# EAGLE schematic OwlPedal (EAGLE 9.6.1)
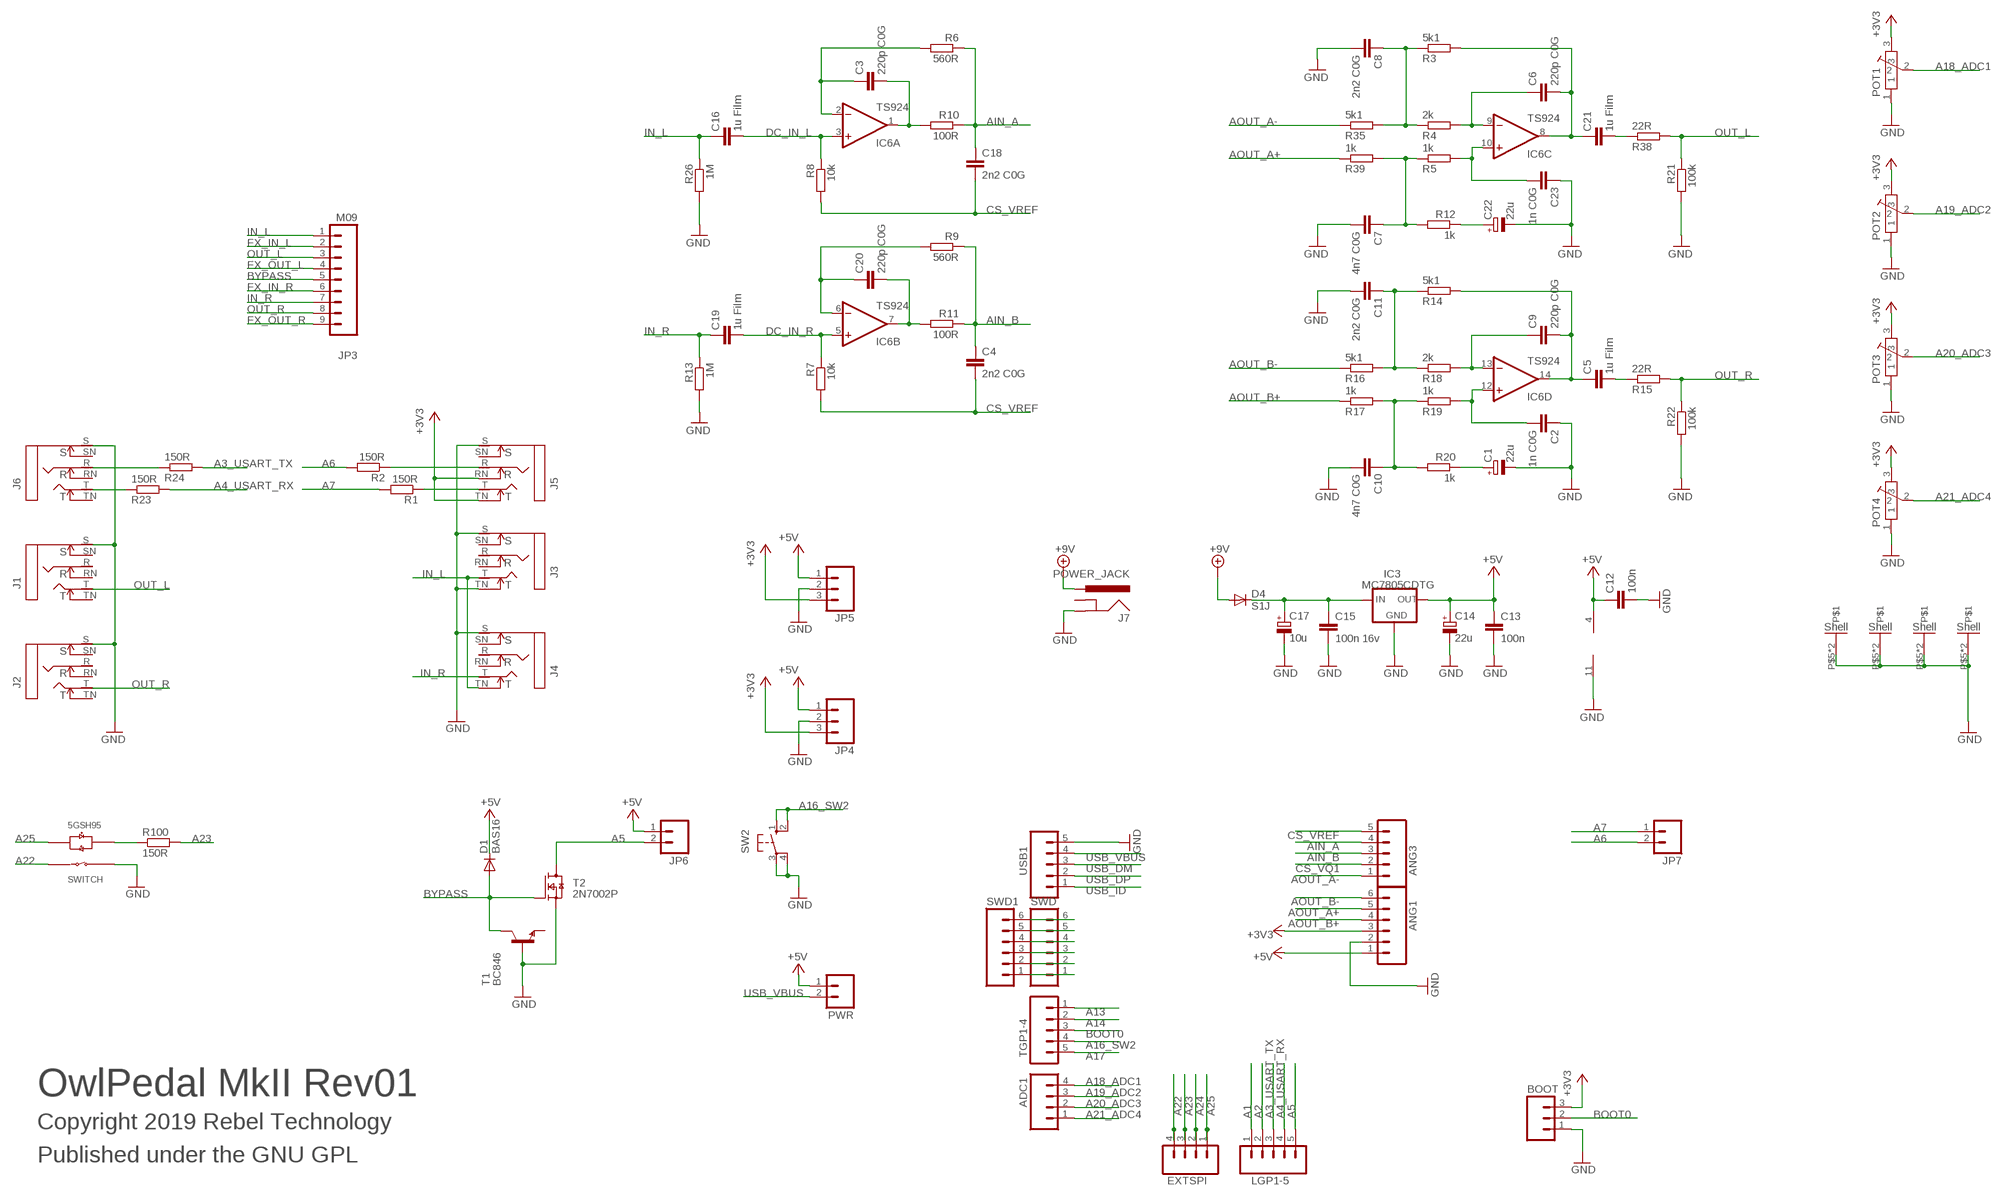
[diagram p0: schematic, sheet 1]

## Parts
ADC1  M04PTH  [1X04]
ANG1  M06SIP  [1X06]
ANG3  M05PTH  [1X05]
BOOT  M03PTH  [1X03]
C1  22u  CPOL-EU153CLV-0505  [CPOL-5]
C2  1n C0G  C-EUC0603  [C0603]
C3  220p C0G  C-EUC0603  [C0603]
C4  2n2 C0G  C-EUC0603  [C0603]
C5  1u Film  C-EUC1210  [C1210]
C6  220p C0G  C-EUC0603  [C0603]
C7  4n7 C0G  C-EUC0603  [C0603]
C8  2n2 C0G  C-EUC0603  [C0603]
C9  220p C0G  C-EUC0603  [C0603]
C10  4n7 C0G  C-EUC0603  [C0603]
C11  2n2 C0G  C-EUC0603  [C0603]
C12  100n  C-EUC0603  [C0603]
C13  100n  C-EUC0603  [C0603]
C14  22u  CPOL-EU153CLV-0505  [CPOL-5]
C15  100n 16v  C-EUC0603  [C0603]
C16  1u Film  C-EUC1210  [C1210]
C17  10u  CPOL-EU153CLV-0505  [CPOL-5]
C18  2n2 C0G  C-EUC0603  [C0603]
C19  1u Film  C-EUC1210  [C1210]
C20  220p C0G  C-EUC0603  [C0603]
C21  1u Film  C-EUC1210  [C1210]
C22  22u  CPOL-EU153CLV-0505  [CPOL-5]
C23  1n C0G  C-EUC0603  [C0603]
D1  BAS16  [SOT23]
D4  S1J  DIODESMA  [SMA-DIODE]
EXTSPI  M04PTH  [1X04]
IC3  MC7805CDTG  MC78XX  [DPACK]
IC6  TS924  LM324D  [SO14]
J1  NEUTRIK_NMJ6HCD2  [NMJ6HCD2]
J2  NEUTRIK_NMJ6HCD2  [NMJ6HCD2]
J3  NEUTRIK_NMJ6HCD2  [NMJ6HCD2]
J4  NEUTRIK_NMJ6HCD2  [NMJ6HCD2]
J5  NEUTRIK_NMJ6HCD2  [NMJ6HCD2]
J6  NEUTRIK_NMJ6HCD2  [NMJ6HCD2]
J7  POWER_JACK  [DC_JACK_SLOT]
JP3  M09  [1X09]
JP4  M03PTH  [1X03]
JP5  M03PTH  [1X03]
JP6  M02PTH  [1X02]
JP7  M02PTH  [1X02]
LGP1-5  M05PTH  [1X05]
POT1  POT-ALPS-RK09L1140  [POT-ALPS-RK09L1140]
POT2  POT-ALPS-RK09L1140  [POT-ALPS-RK09L1140]
POT3  POT-ALPS-RK09L1140  [POT-ALPS-RK09L1140]
POT4  POT-ALPS-RK09L1140  [POT-ALPS-RK09L1140]
PWR  M02PTH  [1X02]
R1  150R  R-EU_0603  [0603]
R2  150R  R-EU_0603  [0603]
R3  5k1  R-EU_0603  [0603]
R4  2k  R-EU_0603  [0603]
R5  1k  R-EU_0603  [0603]
R6  560R  R-EU_0603  [0603]
R7  10k  R-EU_0603  [0603]
R8  10k  R-EU_0603  [0603]
R9  560R  R-EU_0603  [0603]
R10  100R  R-EU_0603  [0603]
R11  100R  R-EU_0603  [0603]
R12  1k  R-EU_0603  [0603]
R13  1M  R-EU_0603  [0603]
R14  5k1  R-EU_0603  [0603]
R15  22R  R-EU_0603  [0603]
R16  5k1  R-EU_0603  [0603]
R17  1k  R-EU_0603  [0603]
R18  2k  R-EU_0603  [0603]
R19  1k  R-EU_0603  [0603]
R20  1k  R-EU_0603  [0603]
R21  100k  R-EU_0603  [0603]
R22  100k  R-EU_0603  [0603]
R23  150R  R-EU_0603  [0603]
R24  150R  R-EU_0603  [0603]
R26  1M  R-EU_0603  [0603]
R35  5k1  R-EU_0603  [0603]
R38  22R  R-EU_0603  [0603]
R39  1k  R-EU_0603  [0603]
R100  150R  R-EU_0603  [0603]
SW2  10-XX  [B3F-10XX]
SWD  M06SIP  [1X06]
SWD1  M06SIP  [1X06]
T1  BC846  [SOT23]
T2  2N7002P  [SOT23]
TGP1-4  M05PTH  [1X05]
U$1  5GTH9  [5GTH9]
USB1  M05PTH  [1X05]

## Nets
+3V3: ANG1.3 BOOT.3 J5.RN J5.TN JP4.3 JP5.3 POT1.3 POT2.3 POT3.3 POT4.3
+5V: ANG1.1 C12.1 C13.1 C14.+ D1.3(K) IC3.3(OUT) IC6.4(P:V+) JP4.1 JP5.1 JP6.1 PWR.1
+9V: D4.A J7.PWR
A1: LGP1-5.1
A2: LGP1-5.2
A3_USART_TX: LGP1-5.3 R24.2
A4_USART_RX: LGP1-5.4 R23.2
A5: JP6.2 LGP1-5.5 T2.3(D)
A6: JP7.2 R2.2
A7: JP7.1 R1.2
A13: TGP1-4.1
A14: TGP1-4.2
A16_SW2: SW2.1(S) SW2.2(S1) TGP1-4.4
A17: TGP1-4.5
A18_ADC1: ADC1.4 POT1.2
A19_ADC2: ADC1.3 POT2.2
A20_ADC3: ADC1.2 POT3.2
A21_ADC4: ADC1.1 POT4.2
A22: EXTSPI.4 U$1.4(SWITCH_A)
A23: EXTSPI.3 R100.2
A24: EXTSPI.2
A25: EXTSPI.1 U$1.-2(LED_G+)
AIN_A: ANG3.4 C18.1 R6.1 R10.1
AIN_B: ANG3.3 C4.1 R9.1 R11.1
AOUT_A+: ANG1.5 R39.1
AOUT_A-: ANG3.1 R35.1
AOUT_B+: ANG1.4 R17.1
AOUT_B-: ANG1.6 R16.1
BOOT0: BOOT.2 TGP1-4.3
BYPASS: D1.1(A) JP3.5 T1.3(C) T2.1(G)
CS_VQ1: ANG3.2
CS_VREF: ANG3.5 C4.2 C18.2 R7.2 R8.2
DC_IN_L: C16.1 IC6.3(A:+IN) R8.1
DC_IN_R: C19.1 IC6.5(B:+IN) R7.1
FX_IN_L: JP3.2
FX_IN_R: JP3.6
FX_OUT_L: JP3.4
FX_OUT_R: JP3.9
GND: ANG1.2 BOOT.1 C1.- C2.1 C7.2 C8.2 C10.2 C11.2 C12.2 C13.2 C14.- C15.2 C17.- C22.- C23.1 IC3.4(GND) IC6.11(P:V-) J1.S J2.S J3.S J3.TN J4.S J5.S J6.S J7.GND JP4.2 JP5.2 POT1.1 POT1.P$5 POT1.P$6 POT2.1 POT2.P$5 POT2.P$6 POT3.1 POT3.P$5 POT3.P$6 POT4.1 POT4.P$5 POT4.P$6 R13.2 R21.2 R22.2 R26.2 SW2.3(P) SW2.4(P1) T1.1(B) T2.2(S) U$1.1(SWITCH_B) USB1.5
IN_L: C16.2 J3.T J4.TN JP3.1 R26.1
IN_R: C19.2 J4.T JP3.7 R13.1
N$2: J6.R R24.1
N$3: SWD1.1 SWD.1
N$5: SWD1.2 SWD.2
N$6: SWD1.3 SWD.3
N$7: SWD1.4 SWD.4
N$8: SWD1.5 SWD.5
N$9: SWD1.6 SWD.6
N$10: R100.1 U$1.+3(LED_R+)
N$11: C6.2 C21.1 IC6.8(C:OUT) R3.2
N$12: J5.R R2.1
N$13: C8.1 R3.1 R4.1 R35.2
N$14: C20.1 IC6.6(B:-IN) R9.2
N$15: J5.T R1.1
N$16: C6.1 IC6.9(C:-IN) R4.2
N$17: C23.2 IC6.10(C:+IN) R5.2
N$18: C7.1 R5.1 R12.2 R39.2
N$19: C9.1 IC6.13(D:-IN) R18.2
N$20: C2.2 IC6.12(D:+IN) R19.2
N$21: C10.1 R17.2 R19.1 R20.2
N$22: C3.1 IC6.2(A:-IN) R6.2
N$23: C3.2 IC6.1(A:OUT) R10.2
N$24: C11.1 R14.1 R16.2 R18.1
N$25: C20.2 IC6.7(B:OUT) R11.2
N$26: J6.T R23.1
N$27: C21.2 R38.1
N$29: C22.+ R12.1
N$31: C1.+ R20.1
N$37: C5.1 C9.2 IC6.14(D:OUT) R14.2
N$38: C5.2 R15.1
N$51: C15.1 C17.+ D4.C IC3.1(IN)
OUT_L: J1.T JP3.3 R21.1 R38.2
OUT_R: J2.T JP3.8 R15.2 R22.1
USB_DM: USB1.3
USB_DP: USB1.2
USB_ID: USB1.1
USB_VBUS: PWR.2 USB1.4
Unconnected: J1.R J1.RN J1.SN J1.TN J2.R J2.RN J2.SN J2.TN J3.R J3.RN J3.SN J4.R J4.RN J4.SN J5.SN J6.RN J6.SN J6.TN J7.GNDBREAK T1.2(E)

## Notes on the sheet
- OwlPedal MkII Rev01
- Copyright 2019 Rebel Technology
- Published under the GNU GPL

## Library data of the parts
ADC1 EXTSPI = SparkFun:M04: Header 4 Standard 4-pin 0.1" header. Use with straight break away headers (SKU : PRT-00116), right angle break away headers (PRT-00553), swiss pins (PRT-00743), machine pins (PRT-00117), and female headers (PRT-00115). Molex polarized connector foot print use with SKU : PRT-08231 with associated crimp pins and housings. 1MM SMD Version SKU: PRT-10208
ANG1 SWD SWD1 = SparkFun:M06: Header 6 Standard 6-pin 0.1" header. Use with straight break away headers (SKU : PRT-00116), right angle break away headers (PRT-00553), swiss pins (PRT-00743), machine pins (PRT-00117), and female headers (PRT-00115). Molex polarized connector foot print use with SKU : PRT-08094 with associated crimp pins and housings. NOTES ON THE VARIANTS LOCK and LOCK_LONGPADS... This footprint was designed to help hold the alignment of a through-hole component (i.e. 6-pin header) while soldering it into place. You may notice that each hole has been shifted either up or down by 0.005 of an inch from it's more standard position (which is a perfectly straight line). This slight alteration caused the pins (the squares in the middle) to touch the edges of the holes. Because they are alternating, it causes a "brace" to hold the component in place. 0.005 has proven to be the perfect amount of "off-center" position when using our standard breakaway headers. Although looks a little odd when you look at the bare footprint, once you have a header in there, the alteration is very hard to notice. Also, if you push a header all the way into place, it is covered up entirely on the bottom side. This idea of altering the position of holes to aid alignment will be further integrated into the Sparkfun Library for other footprints. It can help hold any component with 3 or more connection pins.
ANG3 LGP1-5 TGP1-4 USB1 = SparkFun:M05: Header 5 Standard 5-pin 0.1" header. Use with straight break away headers (SKU : PRT-00116), right angle break away headers (PRT-00553), swiss pins (PRT-00743), machine pins (PRT-00117), and female headers (PRT-00115). Molex polarized connector foot print use with SKU : PRT-08230 with associated crimp pins and housings.
BOOT JP4 JP5 = SparkFun:M03: Header 3 Standard 3-pin 0.1" header. Use with straight break away headers (SKU : PRT-00116), right angle break away headers (PRT-00553), swiss pins (PRT-00743), machine pins (PRT-00117), and female headers (PRT-00115). Molex polarized connector foot print use with SKU : PRT-08232 with associated crimp pins and housings.
C1 C14 C17 C22 = Rebel:CPOL-EU: POLARIZED CAPACITOR, European symbol
C2-C4 C6-C12 C18 C20 C23 = resistor:C-EU: CAPACITOR, European symbol
C5 C13 C15 C16 C19 C21 = Rebel:C-EU: CAPACITOR, European symbol
D1 = NXP_60_26022015:BAS16: High-speed switching diode High-speed switching diode, encapsulated in small Surface-Mounted Device (SMD) plastic packages. AAL Eindhoven MK
D4 = SparkFun:DIODE: Diode These are standard reverse protection diodes and small signal diodes. SMA package can handle up to about 1A. SOD-323 can handle about 200mA. What the SOD-323 package when ordering, there are some mfgs out there that are 5-pin packages.
IC3 = James:MC78XX: VOLTAGE REGULATOR; OC_FARNELL: 2296028
IC6 = linear:LM324: OP AMP
J1-J6 = neutrik_jacks:NEUTRIK_NMJ6HCD2
J7 = Rebel:POWER_JACK: Power Jack This is the standard 5.5mm barrel jack for power. The PTH is the most common, proven, reliable, footprint. All others are experimental. The Slot footprint only works if the mill layer is transmitted to the PCB fab house so be warned. Spark Fun Electronics SKU : PRT-00119. Mating wall wart : TOL-00298 (and others)
JP3 = SparkFun:M09: Header 9 Standard 9-pin 0.1" header. Use with straight break away headers (SKU : PRT-00116), right angle break away headers (PRT-00553), swiss pins (PRT-00743), machine pins (PRT-00117), and female headers (PRT-00115).
JP6 JP7 PWR = SparkFun:M02: Header 2 Standard 2-pin 0.1" header. Use with straight break away headers (SKU : PRT-00116), right angle break away headers (PRT-00553), swiss pins (PRT-00743), machine pins (PRT-00117), and female headers (PRT-00115). Molex polarized connector foot print use with SKU : PRT-08233 with associated crimp pins and housings.
POT1-POT4 = Rebel:POT-ALPS-RK09L
R1-R24 R26 R35 R38 R39 R100 = Rebel:R-EU_: RESISTOR, European symbol
SW2 = switch-omron:10-XX: OMRON SWITCH; MPN: B3F-1000; OC_FARNELL: 176432; OC_NEWARK: 36M3542
T1 = NXP_60_26022015:BC846: 65 V, 100 mA NPN general-purpose transistors AAL Eindhoven MK
T2 = NXP_60_26022015:2N7002: N-channel TrenchMOS FET N-channel enhancement mode Field-Effect Transistor (FET) in a plastic package using TrenchMOS technology. AAL Eindhoven MK
U$1 = SWITCH-5GTH9:5GTH9